# Altium schematic sheet P04_MPU3.SchDoc
size A
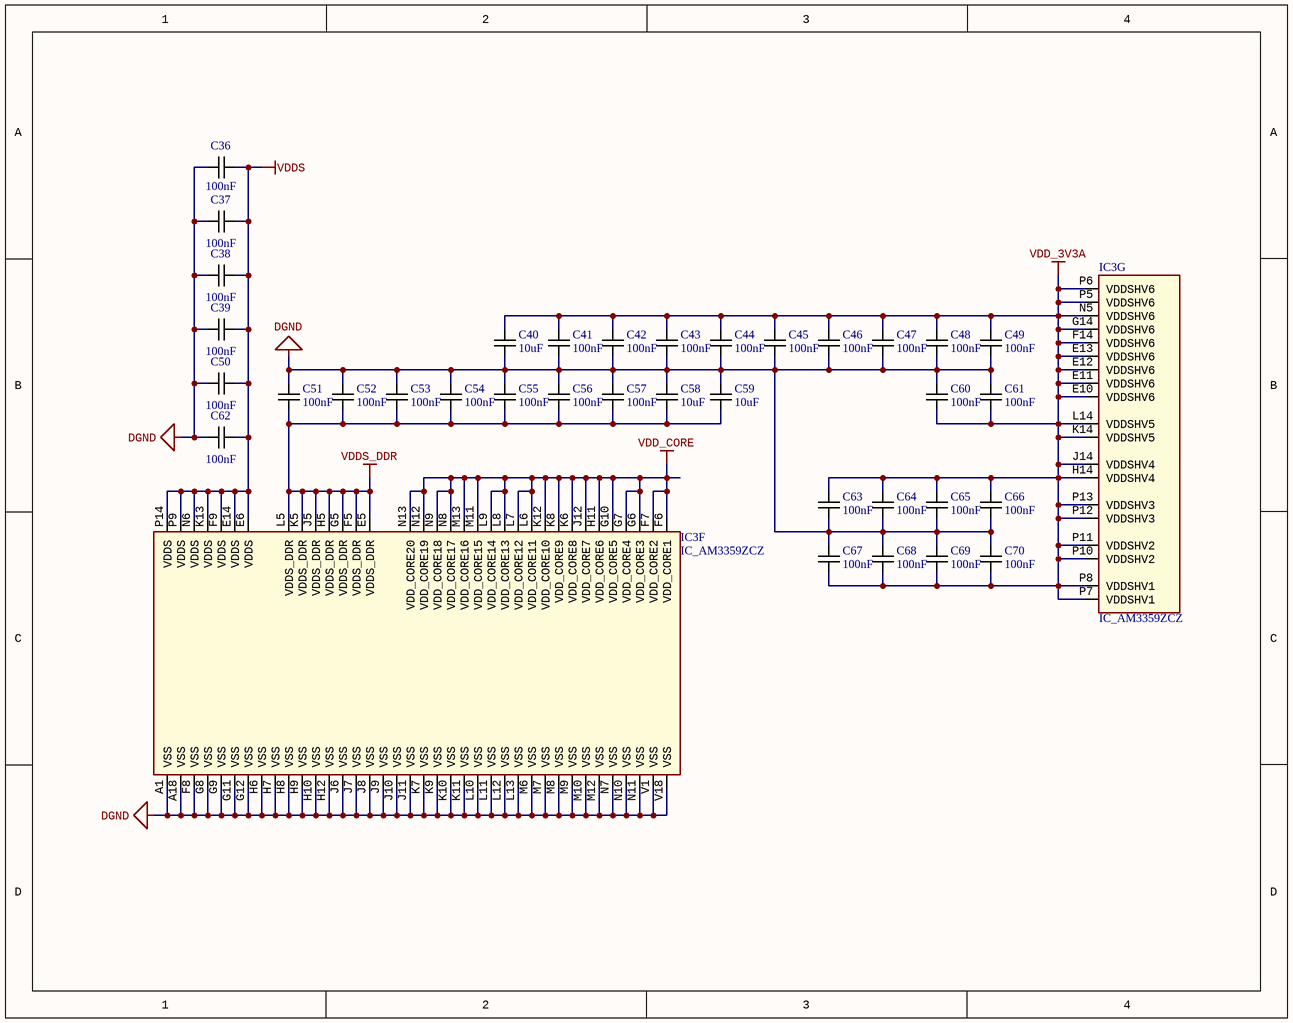
[diagram p0: P04_MPU3.SchDoc]

## Parts
C36  Capacitance: 100nF  [CAP0402]  (hidden comment: C0402C104K4RACTU)
C37  Capacitance: 100nF  [CAP0402]  (hidden comment: C0402C104K4RACTU)
C38  Capacitance: 100nF  [CAP0402]  (hidden comment: C0402C104K4RACTU)
C39  Capacitance: 100nF  [CAP0402]  (hidden comment: C0402C104K4RACTU)
C40  Capacitance: 10uF  [CAP0805]  (hidden comment: C2012X6S1A106K085AC)
C41  Capacitance: 100nF  [CAP0402]  (hidden comment: C0402C104K4RACTU)
C42  Capacitance: 100nF  [CAP0402]  (hidden comment: C0402C104K4RACTU)
C43  Capacitance: 100nF  [CAP0402]  (hidden comment: C0402C104K4RACTU)
C44  Capacitance: 100nF  [CAP0402]  (hidden comment: C0402C104K4RACTU)
C45  Capacitance: 100nF  [CAP0402]  (hidden comment: C0402C104K4RACTU)
C46  Capacitance: 100nF  [CAP0402]  (hidden comment: C0402C104K4RACTU)
C47  Capacitance: 100nF  [CAP0402]  (hidden comment: C0402C104K4RACTU)
C48  Capacitance: 100nF  [CAP0402]  (hidden comment: C0402C104K4RACTU)
C49  Capacitance: 100nF  [CAP0402]  (hidden comment: C0402C104K4RACTU)
C50  Capacitance: 100nF  [CAP0402]  (hidden comment: C0402C104K4RACTU)
C51  Capacitance: 100nF  [CAP0402]  (hidden comment: C0402C104K4RACTU)
C52  Capacitance: 100nF  [CAP0402]  (hidden comment: C0402C104K4RACTU)
C53  Capacitance: 100nF  [CAP0402]  (hidden comment: C0402C104K4RACTU)
C54  Capacitance: 100nF  [CAP0402]  (hidden comment: C0402C104K4RACTU)
C55  Capacitance: 100nF  [CAP0402]  (hidden comment: C0402C104K4RACTU)
C56  Capacitance: 100nF  [CAP0402]  (hidden comment: C0402C104K4RACTU)
C57  Capacitance: 100nF  [CAP0402]  (hidden comment: C0402C104K4RACTU)
C58  Capacitance: 10uF  [CAP0805]  (hidden comment: C2012X6S1A106K085AC)
C59  Capacitance: 10uF  [CAP0805]  (hidden comment: C2012X6S1A106K085AC)
C60  Capacitance: 100nF  [CAP0402]  (hidden comment: C0402C104K4RACTU)
C61  Capacitance: 100nF  [CAP0402]  (hidden comment: C0402C104K4RACTU)
C62  Capacitance: 100nF  [CAP0402]  (hidden comment: C0402C104K4RACTU)
C63  Capacitance: 100nF  [CAP0402]  (hidden comment: C0402C104K4RACTU)
C64  Capacitance: 100nF  [CAP0402]  (hidden comment: C0402C104K4RACTU)
C65  Capacitance: 100nF  [CAP0402]  (hidden comment: C0402C104K4RACTU)
C66  Capacitance: 100nF  [CAP0402]  (hidden comment: C0402C104K4RACTU)
C67  Capacitance: 100nF  [CAP0402]  (hidden comment: C0402C104K4RACTU)
C68  Capacitance: 100nF  [CAP0402]  (hidden comment: C0402C104K4RACTU)
C69  Capacitance: 100nF  [CAP0402]  (hidden comment: C0402C104K4RACTU)
C70  Capacitance: 100nF  [CAP0402]  (hidden comment: C0402C104K4RACTU)
IC3  IC_AM3359ZCZ  [BGA-324]  (parts F,G of 7)

## Nets
DGND: C36.2 C37.2 C38.2 C39.2 C40.2 C41.1 C42.1 C43.1 C44.1 C45.1 C46.1 C47.1 C48.1 C49.1 C50.2 C51.2 C52.2 C53.2 C54.2 C55.2 C56.2 C57.2 C58.1 C59.1 C60.2 C61.2 C62.2 C63.1 C64.1 C65.1 C66.1 C67.2 C68.2 C69.2 C70.2 IC3.A1(VSS) IC3.A18(VSS) IC3.F8(VSS) IC3.G8(VSS) IC3.G9(VSS) IC3.G11(VSS) IC3.G12(VSS) IC3.H6(VSS) IC3.H7(VSS) IC3.H8(VSS) IC3.H9(VSS) IC3.H10(VSS) IC3.H12(VSS) IC3.J6(VSS) IC3.J7(VSS) IC3.J8(VSS) IC3.J9(VSS) IC3.J10(VSS) IC3.J11(VSS) IC3.K7(VSS) IC3.K9(VSS) IC3.K10(VSS) IC3.K11(VSS) IC3.L10(VSS) IC3.L11(VSS) IC3.L12(VSS) IC3.L13(VSS) IC3.M6(VSS) IC3.M7(VSS) IC3.M8(VSS) IC3.M9(VSS) IC3.M10(VSS) IC3.M12(VSS) IC3.N7(VSS) IC3.N10(VSS) IC3.N11(VSS) IC3.V1(VSS) IC3.V18(VSS)
VDD_3V3A: C40.1 C41.2 C42.2 C43.2 C44.2 C45.2 C46.2 C47.2 C48.2 C49.2 C60.1 C61.1 C63.2 C64.2 C65.2 C66.2 C67.1 C68.1 C69.1 C70.1 IC3.E10(VDDSHV6) IC3.E11(VDDSHV6) IC3.E12(VDDSHV6) IC3.E13(VDDSHV6) IC3.F14(VDDSHV6) IC3.G14(VDDSHV6) IC3.H14(VDDSHV4) IC3.J14(VDDSHV4) IC3.K14(VDDSHV5) IC3.L14(VDDSHV5) IC3.N5(VDDSHV6) IC3.P5(VDDSHV6) IC3.P6(VDDSHV6) IC3.P7(VDDSHV1) IC3.P8(VDDSHV1) IC3.P10(VDDSHV2) IC3.P11(VDDSHV2) IC3.P12(VDDSHV3) IC3.P13(VDDSHV3)
VDD_CORE: IC3.F6(VDD_CORE1) IC3.F7(VDD_CORE2) IC3.G6(VDD_CORE3) IC3.G7(VDD_CORE4) IC3.G10(VDD_CORE5) IC3.H11(VDD_CORE6) IC3.J12(VDD_CORE7) IC3.K6(VDD_CORE8) IC3.K8(VDD_CORE9) IC3.K12(VDD_CORE10) IC3.L6(VDD_CORE11) IC3.L7(VDD_CORE12) IC3.L8(VDD_CORE13) IC3.L9(VDD_CORE14) IC3.M11(VDD_CORE15) IC3.M13(VDD_CORE16) IC3.N8(VDD_CORE17) IC3.N9(VDD_CORE18) IC3.N12(VDD_CORE19) IC3.N13(VDD_CORE20)
VDDS: C36.1 C37.1 C38.1 C39.1 C50.1 C62.1 IC3.E6(VDDS) IC3.E14(VDDS) IC3.F9(VDDS) IC3.K13(VDDS) IC3.N6(VDDS) IC3.P9(VDDS) IC3.P14(VDDS)
VDDS_DDR: C51.1 C52.1 C53.1 C54.1 C55.1 C56.1 C57.1 C58.2 C59.2 IC3.E5(VDDS_DDR) IC3.F5(VDDS_DDR) IC3.G5(VDDS_DDR) IC3.H5(VDDS_DDR) IC3.J5(VDDS_DDR) IC3.K5(VDDS_DDR) IC3.L5(VDDS_DDR)

## Library data of the parts
C36-C39 C41-C57 C60-C70 = CAP_100nF: MLCC 100nF 0402 SMD; Manufacturer: KEMET; Tolerance: 10%; Voltage Rating (DC): 16V; Dielectric: X7R; Dissipation Factor: 3.5%; Supplier 1: Digi-Key; Supplier Part Number 1: 399-3521-1-ND; Manufacturer Part Number: C0402C104K4RACTU; RoHS: Yes; Stock 1: 6512243; Pricing 1: 1=0.10000, 10=0.04200, 100=0.01860, 500=0.01328, 1000=0.01044, 2500=0.00949, 5000=0.00873 (USD); Packaging: Tape and Reel; Mount: Surface Mount; Case/Package: 0402; Case Code (Imperial): 0402; Case Code (Metric): 1005; Contact Plating: Tin,Matte; Min Operating Temperature: -55°C; Max Operating Temperature: 125°C; Package Quantity: 10000; Voltage Rating: 16V; Termination: SMD/SMT; Length: 1mm; Height: 0.5mm; Width: 0.5mm; Depth: 0.5mm; Radiation Hardening: No; ComponentLink2URL: https://datasheet.ciiva.com/18192/getdatasheetpartid-385384-18192412.pdf?src-supplier=Verical; ComponentLink2Description: Datasheet
C40 C58 C59 = CAP_10uF: MLCC 10uF 0805 SMD; Manufacturer: TDK; Tolerance: 10%; Dielectric Material: Ceramic; Voltage Rating: 10V; Dielectric: X6S; Supplier 1: Digi-Key; Supplier Part Number 1: 445-7613-1-ND; Manufacturer Part Number: C2012X6S1A106K085AC; RoHS: Yes; Stock 1: 46852; Pricing 1: 1=0.30000, 10=0.20500, 100=0.11610, 500=0.08198, 1000=0.07173 (USD); Packaging: Tape and Reel; Mount: Surface Mount; Case/Package: 0805; Weight: 0.000194oz; Case Code (Metric): 2012; Case Code (Imperial): 0805; Min Operating Temperature: -55°C; Max Operating Temperature: 105°C; Termination: SMD/SMT; Package Quantity: 4000; Voltage Rating (DC): 10V; Composition: Ceramic; Length: 2mm; Height: 1.25mm; Depth: 1.25mm; Width: 0.049inch; Thickness: 0.037inch; REACH SVHC: No SVHC; Lead Free: Lead Free; ComponentLink3URL: https://datasheet.ciiva.com/6290/tdkmlcccaprange-6290501.pdf?src-supplier=Digi-Key; ComponentLink3Description: Datasheet
IC3 = IC_AM335X_ZCE_1: SubArctic Cortex A8 Processor 18x18; Manufacturer: Texas Instruments; Manufacturer Part Number: XAM3359ZCZ; Processor Type: ARM Microprocessor; Voltage: 1.06 V ~ 1.15 V; Supplier 1: Digi-Key; Supplier Part Number 1: 296-35073-ND; RoHS: RoHS Compliant; Category: Integrated Circuits (ICs); Stock 1: 16; Pricing 1: 1=33.5, 10=30.988, 100=26.465, 250=24.28752, 500=23.115, 1000=21.775, 2500=21.105, 5000=20.6025, 10000=20.1 (USD); Features: -; Speed: -; Mounting Type: Surface Mount; Package / Case: 324-LFBGA; Supplier Device Package: 324-NFBGA(15x15); Packaging: Tray; ComponentLink1URL: http://www.ti.com/lit/ds/symlink/am3354.pdf; ComponentLink1Description: http://www.ti.com/lit/ds/symlink/am3354.pdf